# Altium project FPGA_Project.PrjPCB
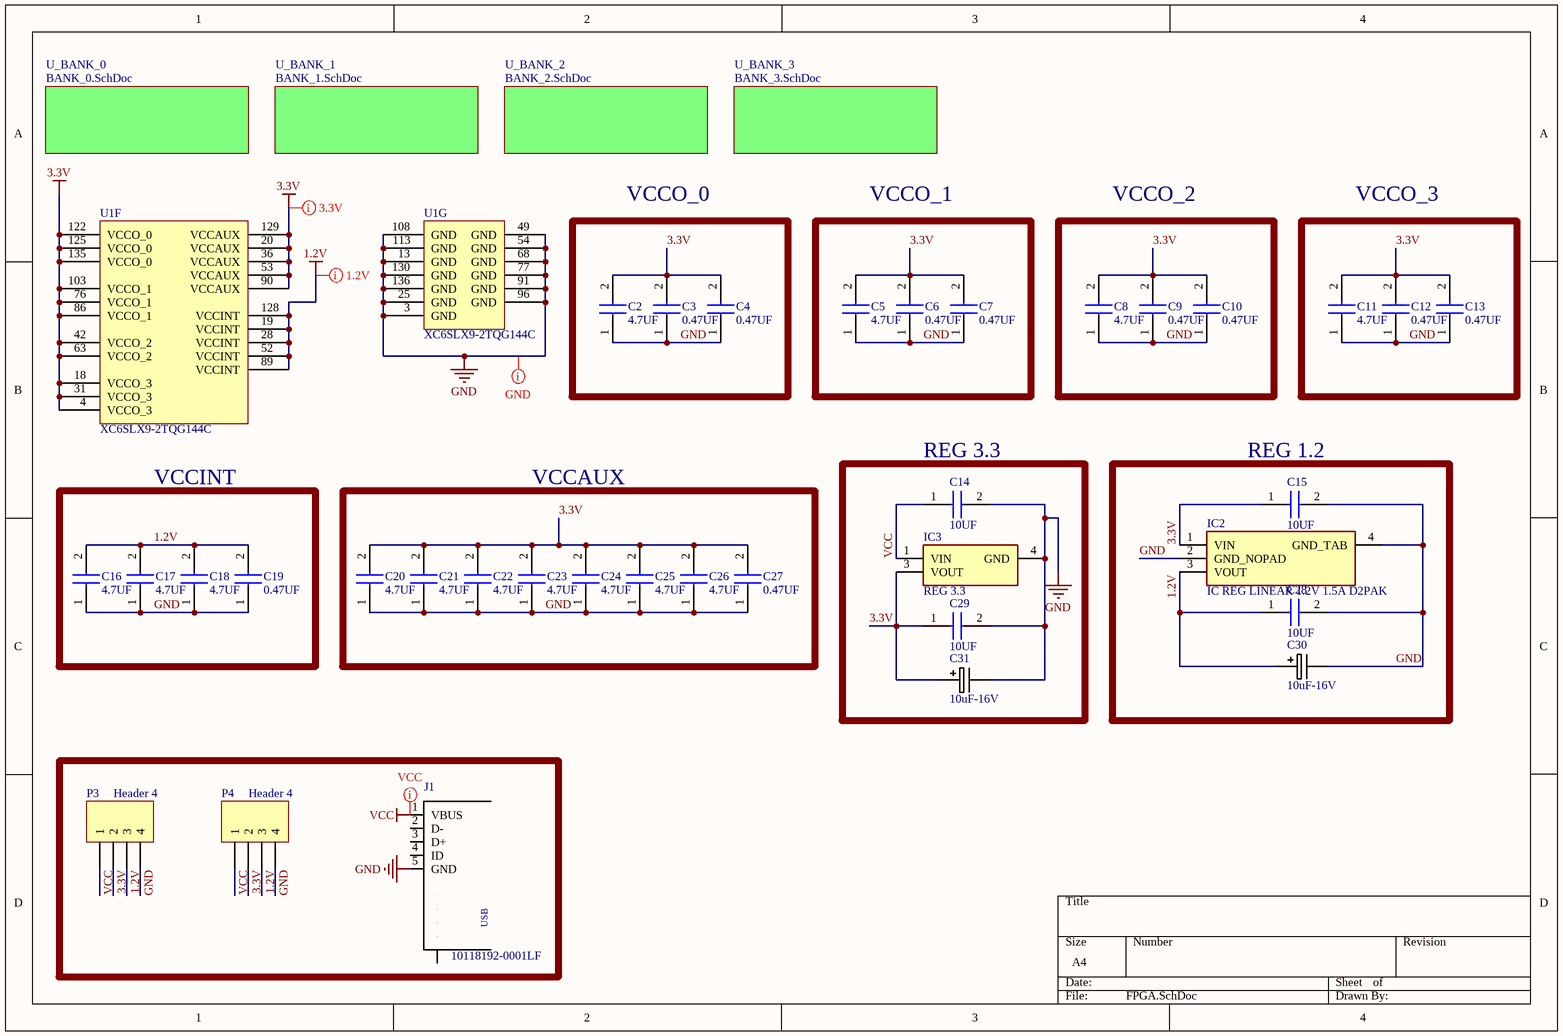
[diagram p0: FPGA.SchDoc]
5 sheets, 57 parts. Net scope: global (net labels, ports and power ports of the same name join across sheets).
Board file: FPGA_PCB.PcbDoc
Sheets:
  FPGA.SchDoc
    U_BANK_0 = BANK_0.SchDoc
    U_BANK_1 = BANK_1.SchDoc
    U_BANK_2 = BANK_2.SchDoc
    U_BANK_3 = BANK_3.SchDoc

## Sheet FPGA.SchDoc
size A4

### Parts
C2  4.7UF  [CAPC2012X135N]
C3  0.47UF  [CAPC2012X135N]
C4  0.47UF  [CAPC2012X135N]
C5  4.7UF  [CAPC2012X135N]
C6  0.47UF  [CAPC2012X135N]
C7  0.47UF  [CAPC2012X135N]
C8  4.7UF  [CAPC2012X135N]
C9  0.47UF  [CAPC2012X135N]
C10  0.47UF  [CAPC2012X135N]
C11  4.7UF  [CAPC2012X135N]
C12  0.47UF  [CAPC2012X135N]
C13  0.47UF  [CAPC2012X135N]
C14  10UF  [CAPC2012X135N]
C15  10UF  [CAPC2012X135N]
C16  4.7UF  [CAPC2012X135N]
C17  4.7UF  [CAPC2012X135N]
C18  4.7UF  [CAPC2012X135N]
C19  0.47UF  [CAPC2012X135N]
C20  4.7UF  [CAPC2012X135N]
C21  4.7UF  [CAPC2012X135N]
C22  4.7UF  [CAPC2012X135N]
C23  4.7UF  [CAPC2012X135N]
C24  4.7UF  [CAPC2012X135N]
C25  4.7UF  [CAPC2012X135N]
C26  4.7UF  [CAPC2012X135N]
C27  0.47UF  [CAPC2012X135N]
C28  10UF  [CAPC2012X135N]
C29  10UF  [CAPC2012X135N]
C30  10uF-16V  [PANACAP-b]
C31  10uF-16V  [PANACAP-b]
IC2  IC REG LINEAR 1.2V 1.5A D2PAK  [TO254P1420X457-4N]
IC3  REG 3.3  [NCV8674DS50R4G]
J1  10118192-0001LF  [10118192-0001LF_10118192-0001LF(Primary)]
P3  Header 4  [HDR1X4]
P4  Header 4  [HDR1X4]
U1  XC6SLX9-2TQG144C  [TQG144_N]  (parts F,G of 7)

### Blocks framed on the sheet
VCCO_0: C2-C4
VCCO_1: C5-C7
VCCO_2: C8-C10
VCCO_3: C11-C13
VCCINT: C16-C19
VCCAUX: C20-C27
REG 3.3: C14 C29 C31 IC3
REG 1.2: C15 C28 C30 IC2

### Sub-sheets
U_BANK_0 = BANK_0.SchDoc: no entries
U_BANK_1 = BANK_1.SchDoc: no entries
U_BANK_2 = BANK_2.SchDoc: no entries
U_BANK_3 = BANK_3.SchDoc: no entries

### Nets
1.2V: C16.2 C17.2 C18.2 C19.2 C28.1 C30.+ IC2.3(VOUT) P3.3 P4.3 U1.19(VCCINT) U1.28(VCCINT) U1.52(VCCINT) U1.89(VCCINT) U1.128(VCCINT)
3.3V: C2.2 C3.2 C4.2 C5.2 C6.2 C7.2 C8.2 C9.2 C10.2 C11.2 C12.2 C13.2 C15.1 C20.2 C21.2 C22.2 C23.2 C24.2 C25.2 C26.2 C27.2 C29.1 C31.+ IC2.1(VIN) IC3.3(VOUT) P3.2 P4.2 U1.4(VCCO_3) U1.18(VCCO_3) U1.20(VCCAUX) U1.31(VCCO_3) U1.36(VCCAUX) U1.42(VCCO_2) U1.53(VCCAUX) U1.63(VCCO_2) U1.76(VCCO_1) U1.86(VCCO_1) U1.90(VCCAUX) U1.103(VCCO_1) U1.122(VCCO_0) U1.125(VCCO_0) U1.129(VCCAUX) U1.135(VCCO_0)
GND: C2.1 C3.1 C4.1 C5.1 C6.1 C7.1 C8.1 C9.1 C10.1 C11.1 C12.1 C13.1 C14.2 C15.2 C16.1 C17.1 C18.1 C19.1 C20.1 C21.1 C22.1 C23.1 C24.1 C25.1 C26.1 C27.1 C28.2 C29.2 C30.- C31.- IC2.2(GND_NOPAD) IC2.4(GND_TAB) IC3.4(GND) J1.5(GND) P3.4 P4.4 U1.3(GND) U1.13(GND) U1.25(GND) U1.49(GND) U1.54(GND) U1.68(GND) U1.77(GND) U1.91(GND) U1.96(GND) U1.108(GND) U1.113(GND) U1.130(GND) U1.136(GND)
VCC: C14.1 IC3.1(VIN) J1.1(VBUS) P3.1 P4.1

Not connected (* = marked no-connect by the designer): J1 2(D-) 3(D+) 4(ID) M1(S) M2(S) S1(S) S2(S) S3(S) S4(S)

### Layout directives
rule Width Constraint [Pref Width = 15.748mil    Min Width = 11.811mil    Max Width = 15.748mil]: 1.2V, 3.3V, GND, VCC

### Notes on the sheet
- (in symbol 10118192-0001LF) USB

### Library data of the parts
C2 C5 C8 C11 C16-C18 C20-C26 = CAP CER 4.7UF 16V X5R 0805: Capacitor; Manufacturer_Name: Wurth Elektronik; Manufacturer_Part_Number: 885012107013; Datasheet Link: https://katalog.we-online.com/pbs/datasheet/885012107013.pdf; Height: 1.35mm; Mouser Part Number: 710-885012107013; Mouser Price/Stock: https://www.mouser.com/Search/Refine.aspx?Keyword=710-885012107013; RS Part Number: 1814065P; RS Price/Stock: http://uk.rs-online.com/web/p/products/1814065P
C3 C4 C6 C7 C9 C10 C12 C13 C19 C27 = CAP CER 0.47UF 16V X7R 0805: Capacitor; Manufacturer_Name: Wurth Elektronik; Manufacturer_Part_Number: 885012207049; Datasheet Link: https://katalog.we-online.com/pbs/datasheet/885012207049.pdf; Height: 1.35mm; Mouser Part Number: 710-885012207049; Mouser Price/Stock: https://www.mouser.com/Search/Refine.aspx?Keyword=710-885012207049
C14 C15 C28 C29 = CAP CER 10UF 16V X5R 0805: Capacitor; Manufacturer_Name: Wurth Elektronik; Manufacturer_Part_Number: 885012107013; Datasheet Link: https://katalog.we-online.com/pbs/datasheet/885012107013.pdf; Height: 1.35mm; Mouser Part Number: 710-885012107013; Mouser Price/Stock: https://www.mouser.com/Search/Refine.aspx?Keyword=710-885012107013; RS Part Number: 1814065P; RS Price/Stock: http://uk.rs-online.com/web/p/products/1814065P
C30 C31 = PANACAP-10UF-16V-FK: GENERIC CAPACITOR POLARISED; Supplier 1: Digi-Key; Supplier Part Number 1: PCE3782TR-ND
IC2 = IC REG LINEAR 1.2V 1.5A D2PAK: Integrated Circuit; Manufacturer_Name: ON Semiconductor; Manufacturer_Part_Number: NCP565D2T12G; Allied_Number: 70340882; Datasheet Link: http://www.onsemi.com/pub/Collateral/NCP565-D.PDF; Height: 4.572mm; Mouser Part Number: 863-NCP565D2T12G; Mouser Price/Stock: https://www.mouser.com/Search/Refine.aspx?Keyword=863-NCP565D2T12G; RS Part Number: 0464164; RS Price/Stock: http://uk.rs-online.com/web/p/products/0464164; Allied Price/Stock: http://www.alliedelec.com/on-semiconductor-ncp565d2t12g/70340882/
IC3 = IC REG LINEAR 3.3V 1.5A D2PAK: Integrated Circuit; Manufacturer_Name: ON Semiconductor; Manufacturer_Part_Number: NCP565D2T33R4G; Datasheet Link: https://www.onsemi.com/pub/Collateral/NCP565-D.PDF; Height: 4mm; Mouser Part Number: 863-NCP565D2T33R4G; Mouser Price/Stock: https://www.mouser.com/Search/Refine.aspx?Keyword=863-NCP565D2T33R4G; RS Part Number: 7852432P; RS Price/Stock: http://uk.rs-online.com/web/p/products/7852432P
J1 = 10118192-0001LF: Conn Micro USB Type B RCP 5 POS 0.65mm Solder RA SMD 5 Terminal 1 Port T/R; MF: Amphenol; Price: 0.23 USD; MP: 10118192-0001LF; Availability: Good; SnapEDA_Link: https://www.snapeda.com/parts/10118192-0001LF/Amphenol%20Solar/view-part/?ref=snap; Package: None; Value: *
P3 P4 = Header 4: Header, 4-Pin; LatestRevisionDate: 17-Jul-2002; LatestRevisionNote: Re-released for DXP Platform.; Publisher: Altium Limited
U1 = XC6SLX9-2TQG144C: Spartan-6 LX 1.2V FPGA, 102 User I/Os, 144-Pin TQFP (0.5mm Pitch), Speed Grade 2, Commercial Grade, Pb-Free; DatasheetVersion: ver1.6, Nov-2010; PackageVersion: ver1.2, Jun-2004; PackageReference: TQG144; PackageDescription: 144-Pin Thin Quad Flat Pack (TQG144) - Pb-Free; Code_JEDEC: MS-026-BFB; ComponentLink1Description: Manufacturer URL; ComponentLink1URL: http://www.xilinx.com/; ComponentLink2Description: Spartan-6 Datasheet; ComponentLink2URL: http://www.xilinx.com/support/documentation/data_sheets/ds160.pdf; ComponentLink3Description: Spartan-6 Documents; ComponentLink3URL: http://www.xilinx.com/support/documentation/spartan-6.htm

## Sheet BANK_0.SchDoc
size A4
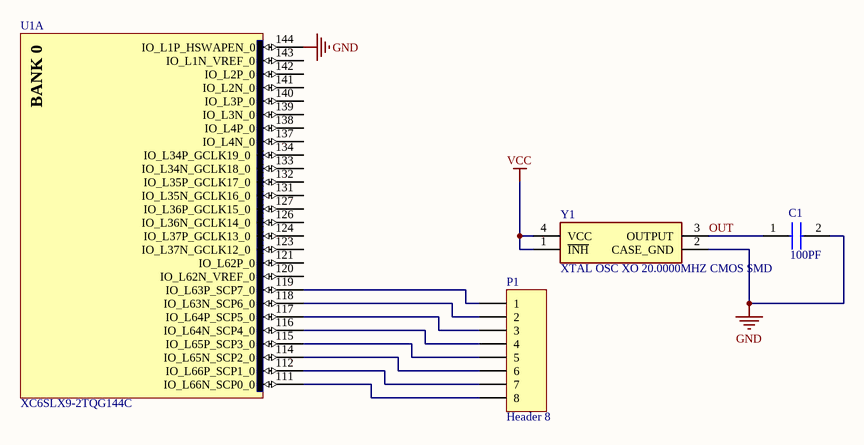
[diagram p1: BANK_0.SchDoc]

### Parts
C1  100PF  [CAPC2012X90N]
P1  Header 8  [HDR1X8]
U1  XC6SLX9-2TQG144C  [TQG144_N]  (part A of 7)
Y1  XTAL OSC XO 20.0000MHZ CMOS SMD  [KC5032A12.0000CM0E00]

### Nets
GND: C1.2 U1.144(IO_L1P_HSWAPEN_0) Y1.2(CASE_GND)
VCC: Y1.1(~{INH}) Y1.4(VCC)
OUT: C1.1 Y1.3(OUTPUT)
NetP1_1: P1.1 U1.119(IO_L63P_SCP7_0)
NetP1_2: P1.2 U1.118(IO_L63N_SCP6_0)
NetP1_3: P1.3 U1.117(IO_L64P_SCP5_0)
NetP1_4: P1.4 U1.116(IO_L64N_SCP4_0)
NetP1_5: P1.5 U1.115(IO_L65P_SCP3_0)
NetP1_6: P1.6 U1.114(IO_L65N_SCP2_0)
NetP1_7: P1.7 U1.112(IO_L66P_SCP1_0)
NetP1_8: P1.8 U1.111(IO_L66N_SCP0_0)

Not connected (* = marked no-connect by the designer): U1 120(IO_L62N_VREF_0) 121(IO_L62P_0) 123(IO_L37N_GCLK12_0) 124(IO_L37P_GCLK13_0) 126(IO_L36N_GCLK14_0) 127(IO_L36P_GCLK15_0) 131(IO_L35N_GCLK16_0) 132(IO_L35P_GCLK17_0) 133(IO_L34N_GCLK18_0) 134(IO_L34P_GCLK19_0) 137(IO_L4N_0) 138(IO_L4P_0) 139(IO_L3N_0) 140(IO_L3P_0) 141(IO_L2N_0) 142(IO_L2P_0) 143(IO_L1N_VREF_0)

### Notes on the sheet
- (in symbol XC6SLX9-2TQG144C, part A) BANK 0

### Library data of the parts
C1 = CAP CER 0.1UF 16V X7R 0805: Capacitor; Manufacturer_Name: Wurth Elektronik; Manufacturer_Part_Number: 885012207045; Datasheet Link: https://katalog.we-online.com/pbs/datasheet/885012207045.pdf; Height: 0.9mm; Mouser Part Number: 710-885012207045; Mouser Price/Stock: https://www.mouser.com/Search/Refine.aspx?Keyword=710-885012207045; RS Part Number: 1814041P; RS Price/Stock: http://uk.rs-online.com/web/p/products/1814041P
P1 = Header 8: Header, 8-Pin; LatestRevisionDate: 17-Jul-2002; LatestRevisionNote: Re-released for DXP Platform.; Publisher: Altium Limited
U1 = XC6SLX9-2TQG144C: as U1 on sheet FPGA; DatasheetVersion: ver1.6, Nov-2010; PackageVersion: ver1.2, Jun-2004; PackageReference: TQG144; PackageDescription: 144-Pin Thin Quad Flat Pack (TQG144) - Pb-Free; Code_JEDEC: MS-026-BFB; ComponentLink1Description: Manufacturer URL; ComponentLink1URL: http://www.xilinx.com/; ComponentLink2Description: Spartan-6 Datasheet; ComponentLink2URL: http://www.xilinx.com/support/documentation/data_sheets/ds160.pdf; ComponentLink3Description: Spartan-6 Documents; ComponentLink3URL: http://www.xilinx.com/support/documentation/spartan-6.htm
Y1 = XTAL OSC XO 20.0000MHZ CMOS SMD: Crystal or Oscillator; Manufacturer_Name: KYOCERA; Manufacturer_Part_Number: KC5032A20.0000CMGE00; Datasheet Link: http://global.kyocera.com/prdct/electro/product/pdf/kc5032a_cm_e.pdf; Mouser Part Number: 581-KC5032A20.CMGE

## Sheet BANK_1.SchDoc
size A4
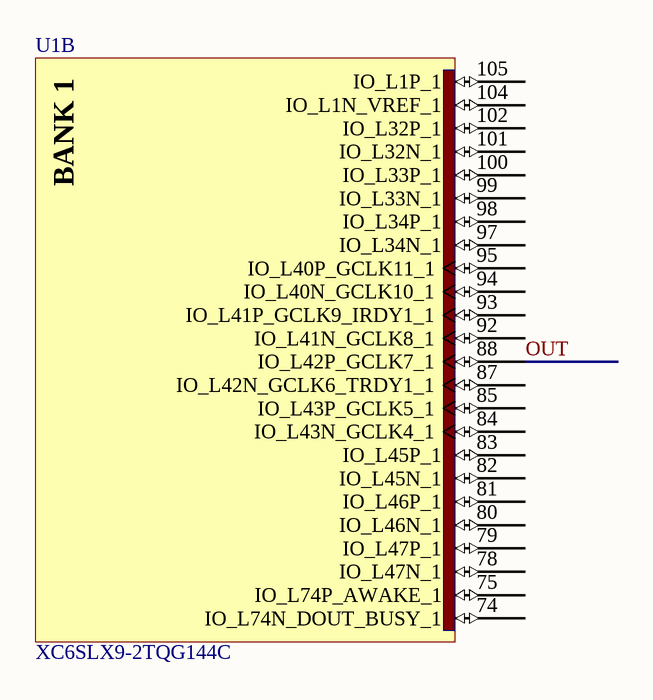
[diagram p2: BANK_1.SchDoc]

### Parts
U1  XC6SLX9-2TQG144C  [TQG144_N]  (part B of 7)

### Nets
OUT: U1.88(IO_L42P_GCLK7_1)

Not connected (* = marked no-connect by the designer): U1 74(IO_L74N_DOUT_BUSY_1) 75(IO_L74P_AWAKE_1) 78(IO_L47N_1) 79(IO_L47P_1) 80(IO_L46N_1) 81(IO_L46P_1) 82(IO_L45N_1) 83(IO_L45P_1) 84(IO_L43N_GCLK4_1) 85(IO_L43P_GCLK5_1) 87(IO_L42N_GCLK6_TRDY1_1) 92(IO_L41N_GCLK8_1) 93(IO_L41P_GCLK9_IRDY1_1) 94(IO_L40N_GCLK10_1) 95(IO_L40P_GCLK11_1) 97(IO_L34N_1) 98(IO_L34P_1) 99(IO_L33N_1) 100(IO_L33P_1) 101(IO_L32N_1) 102(IO_L32P_1) 104(IO_L1N_VREF_1) 105(IO_L1P_1)

### Notes on the sheet
- (in symbol XC6SLX9-2TQG144C, part B) BANK 1

### Library data of the parts
U1 = XC6SLX9-2TQG144C: as U1 on sheet FPGA; DatasheetVersion: ver1.6, Nov-2010; PackageVersion: ver1.2, Jun-2004; PackageReference: TQG144; PackageDescription: 144-Pin Thin Quad Flat Pack (TQG144) - Pb-Free; Code_JEDEC: MS-026-BFB; ComponentLink1Description: Manufacturer URL; ComponentLink1URL: http://www.xilinx.com/; ComponentLink2Description: Spartan-6 Datasheet; ComponentLink2URL: http://www.xilinx.com/support/documentation/data_sheets/ds160.pdf; ComponentLink3Description: Spartan-6 Documents; ComponentLink3URL: http://www.xilinx.com/support/documentation/spartan-6.htm

## Sheet BANK_2.SchDoc
size A4
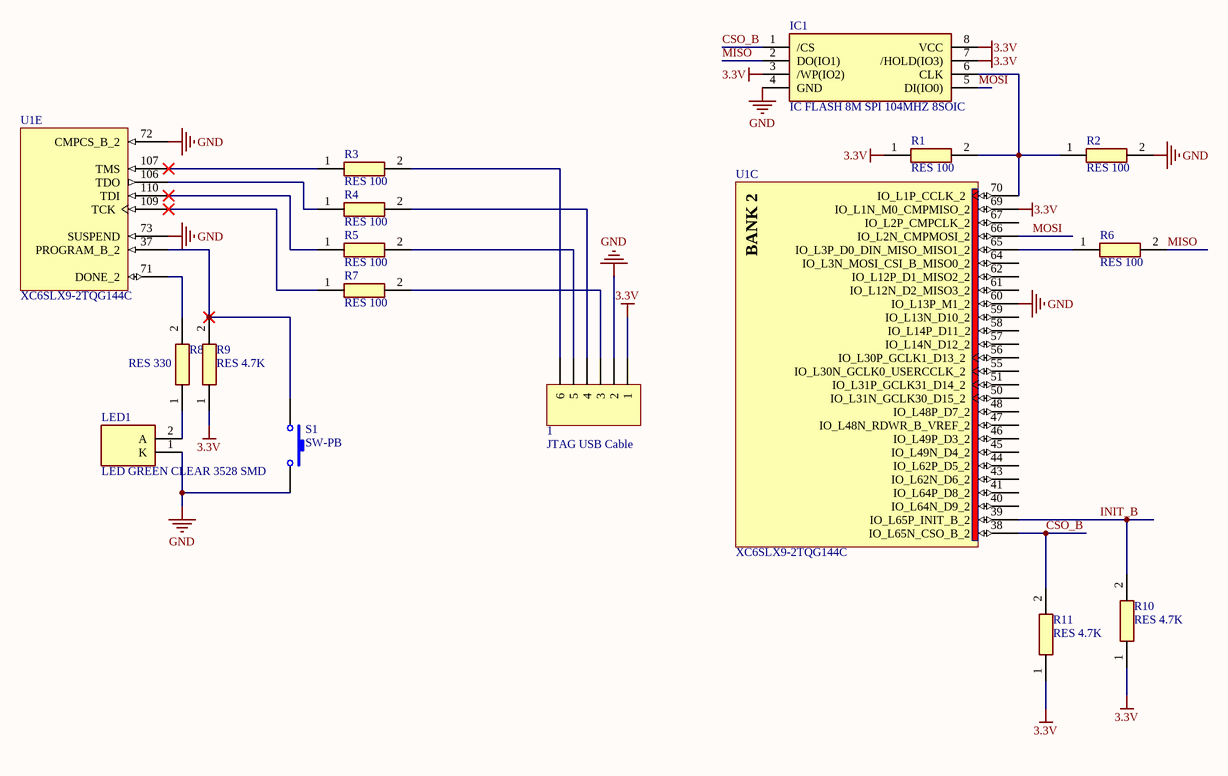
[diagram p3: BANK_2.SchDoc]

### Parts
1  JTAG USB Cable  [HDR1X6]
IC1  IC FLASH 8M SPI 104MHZ 8SOIC  [SOIC127P790X216-8N]
LED1  LED GREEN CLEAR 3528 SMD  [LEDM3528X210N]
R1  RES 100  [RESC2012X65N]
R2  RES 100  [RESC2012X65N]
R3  RES 100  [RESC2012X65N]
R4  RES 100  [RESC2012X65N]
R5  RES 100  [RESC2012X65N]
R6  RES 100  [RESC2012X65N]
R7  RES 100  [RESC2012X65N]
R8  RES 330  [RESC2012X65N]
R9  RES 4.7K  [RESC2012X60N]
R10  RES 4.7K  [RESC2012X60N]
R11  RES 4.7K  [RESC2012X60N]
S1  SW-PB  [SPST-2]
U1  XC6SLX9-2TQG144C  [TQG144_N]  (parts C,E of 7)

### Nets
3.3V: 1.1 IC1.3(/WP(IO2)) IC1.7(/HOLD(IO3)) IC1.8(VCC) R1.1 R9.1 R10.1 R11.1 U1.69(IO_L1N_M0_CMPMISO_2)
GND: 1.2 IC1.4(GND) LED1.1(K) R2.2 S1.2 U1.60(IO_L13P_M1_2) U1.72(CMPCS_B_2) U1.73(SUSPEND)
CSO_B: IC1.1(/CS) R11.2 U1.38(IO_L65N_CSO_B_2)
INIT_B: R10.2 U1.39(IO_L65P_INIT_B_2)
MISO: IC1.2(DO(IO1)) R6.2
MOSI: IC1.5(DI(IO0)) U1.66(IO_L2N_CMPMOSI_2)
Net1_3: 1.3 R7.2
Net1_4: 1.4 R4.2
Net1_5: 1.5 R5.2
Net1_6: 1.6 R3.2
NetIC1_6: IC1.6(CLK) R1.2 R2.1 U1.70(IO_L1P_CCLK_2)
NetLED1_2: LED1.2(A) R8.1
NetR3_1: R3.1 U1.107(TMS)
NetR4_1: R4.1 U1.106(TDO)
NetR5_1: R5.1 U1.110(TDI)
NetR6_1: R6.1 U1.65(IO_L3P_D0_DIN_MISO_MISO1_2)
NetR7_1: R7.1 U1.109(TCK)
NetR8_2: R8.2 U1.71(DONE_2)
NetR9_2: R9.2 S1.1 U1.37(PROGRAM_B_2)

Not connected (* = marked no-connect by the designer): U1 40(IO_L64N_D9_2) 41(IO_L64P_D8_2) 43(IO_L62N_D6_2) 44(IO_L62P_D5_2) 45(IO_L49N_D4_2) 46(IO_L49P_D3_2) 47(IO_L48N_RDWR_B_VREF_2) 48(IO_L48P_D7_2) 50(IO_L31N_GCLK30_D15_2) 51(IO_L31P_GCLK31_D14_2) 55(IO_L30N_GCLK0_USERCCLK_2) 56(IO_L30P_GCLK1_D13_2) 57(IO_L14N_D12_2) 58(IO_L14P_D11_2) 59(IO_L13N_D10_2) 61(IO_L12N_D2_MISO3_2) 62(IO_L12P_D1_MISO2_2) 64(IO_L3N_MOSI_CSI_B_MISO0_2) 67(IO_L2P_CMPCLK_2)

### Notes on the sheet
- (in symbol XC6SLX9-2TQG144C, part C) BANK 2

### Library data of the parts
1 = JTAG USB Cable: DIGILENT         250-003            PROGRAMMING CABLE, JTAG TO USB; Supplier 1: Digi-Key; Manufacturer: Digilent; Manufacturer Part Number: 250-003; Stock 1: 33; Pricing 1: 1=59 (USD); Number of Pins: 6; Package Quantity: 1; REACH SVHC: No SVHC; ComponentLink1URL: http://www.digilentinc.com/Data/Products/JTAG-USB/JTAG-USB%20Cable_rm.pdf?src-supplier=Digi-Key; ComponentLink1Description: http://www.digilentinc.com/Data/Products/JTAG-USB/JTAG-USB%20Cable_rm.pdf?src-supplier=Digi-Key; Category: Programmers; Supplier Part Number 1: 1286-1052-ND
IC1 = IC FLASH 8M SPI 104MHZ 8SOIC: Integrated Circuit; Manufacturer_Name: Winbond; Manufacturer_Part_Number: W25Q80DVSSIG; Datasheet Link: https://www.winbond.com/resource-files/w25q80dv_revf_02112015.pdf; Height: 2.16mm; Mouser Part Number: 454-W25Q80DVSSIG; Mouser Price/Stock: https://www.mouser.com/Search/Refine.aspx?Keyword=454-W25Q80DVSSIG; RS Part Number: 1882614P; RS Price/Stock: http://uk.rs-online.com/web/p/products/1882614P
LED1 = LED GREEN CLEAR 3528 SMD: LED; Manufacturer_Name: Wurth Elektronik; Manufacturer_Part_Number: 150141GS73100; Datasheet Link: https://www.mouser.com/datasheet/2/445/150141GS73100-368683.pdf; Height: 2.1mm; Mouser Part Number: 710-150141GS73100; Mouser Price/Stock: https://www.mouser.com/Search/Refine.aspx?Keyword=710-150141GS73100; RS Part Number: 8154316P; RS Price/Stock: http://uk.rs-online.com/web/p/products/8154316P
R1-R7 = RES SMD 100 OHM 5% 1/8W 0805: Resistor; Manufacturer_Name: TE Connectivity; Manufacturer_Part_Number: CRG0805J100R; Datasheet Link: http://www.te.com/commerce/DocumentDelivery/DDEController?Action=showdoc&DocId=Customer+Drawing%7F1623109%7FBA%7Fpdf%7FEnglish%7FENG_CD_1623109_BA.pdf%7F1623109-1; Height: 0.65mm; Mouser Part Number: 279-CRG0805J100R; Mouser Price/Stock: https://www.mouser.com/Search/Refine.aspx?Keyword=279-CRG0805J100R
R8 = RES SMD 330 OHM 1% 1/8W 0805: Resistor; Manufacturer_Name: TE Connectivity; Manufacturer_Part_Number: CRG0805F330R; Allied_Number: 70063207; Datasheet Link: http://www.te.com/commerce/DocumentDelivery/DDEController?Action=showdoc&DocId=Customer+Drawing%7F1623109%7FBA%7Fpdf%7FEnglish%7FENG_CD_1623109_BA.pdf%7F1623109-1; Height: 0.65mm; Mouser Part Number: 279-CRG0805F330R; Mouser Price/Stock: https://www.mouser.com/Search/Refine.aspx?Keyword=279-CRG0805F330R; RS Part Number: 2230354P; RS Price/Stock: http://uk.rs-online.com/web/p/products/2230354P; Allied Price/Stock: https://www.alliedelec.com/te-connectivity-crg0805f330r/70063207/
R9-R11 = RES SMD 4.7K OHM 1% 1/8W 0805: Resistor; Manufacturer_Name: YAGEO (PHYCOMP); Manufacturer_Part_Number: RC0805FR-074K7L; Datasheet Link: http://www.yageo.com/documents/recent/PYu-RC_Group_51_RoHS_L_10.pdf; Height: 0.6mm; Mouser Part Number: 603-RC0805FR-074K7L; Mouser Price/Stock: https://www.mouser.com/Search/Refine.aspx?Keyword=603-RC0805FR-074K7L; RS Part Number: 6181408; RS Price/Stock: http://uk.rs-online.com/web/p/products/6181408
S1 = SW-PB: Switch; Published: 24-Mar-1999; LatestRevisionDate: 17-Jul-2002; LatestRevisionNote: Re-released for DXP Platform.; PackageReference: SPST-2; Publisher: Altium Limited; PackageDescription: Switch; 2 Leads
U1 = XC6SLX9-2TQG144C: as U1 on sheet FPGA; DatasheetVersion: ver1.6, Nov-2010; PackageVersion: ver1.2, Jun-2004; PackageReference: TQG144; PackageDescription: 144-Pin Thin Quad Flat Pack (TQG144) - Pb-Free; Code_JEDEC: MS-026-BFB; ComponentLink1Description: Manufacturer URL; ComponentLink1URL: http://www.xilinx.com/; ComponentLink2Description: Spartan-6 Datasheet; ComponentLink2URL: http://www.xilinx.com/support/documentation/data_sheets/ds160.pdf; ComponentLink3Description: Spartan-6 Documents; ComponentLink3URL: http://www.xilinx.com/support/documentation/spartan-6.htm

## Sheet BANK_3.SchDoc
size A4
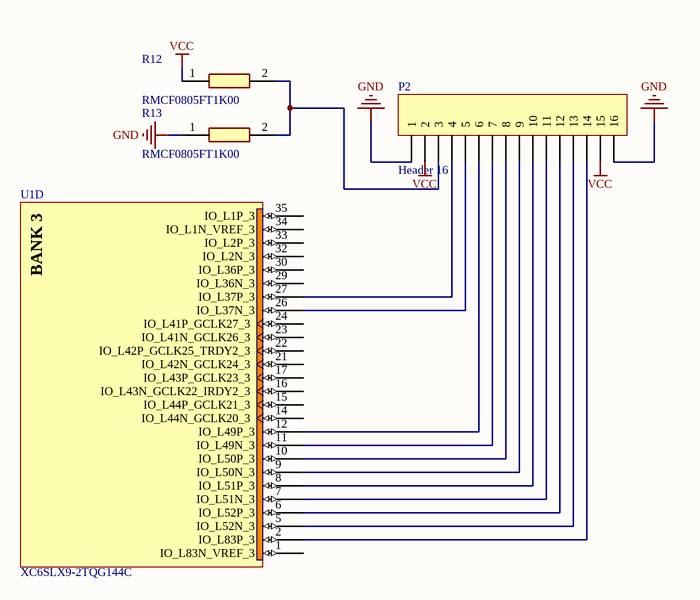
[diagram p4: BANK_3.SchDoc]

### Parts
P2  Header 16  [HDR1X16]
R12  RMCF0805FT1K00  [RESC2012X65N]
R13  RMCF0805FT1K00  [RESC2012X65N]
U1  XC6SLX9-2TQG144C  [TQG144_N]  (part D of 7)

### Nets
GND: P2.1 P2.16 R13.1
VCC: P2.2 P2.15 R12.1
NetP2_3: P2.3 R12.2 R13.2
NetP2_4: P2.4 U1.27(IO_L37P_3)
NetP2_5: P2.5 U1.26(IO_L37N_3)
NetP2_6: P2.6 U1.12(IO_L49P_3)
NetP2_7: P2.7 U1.11(IO_L49N_3)
NetP2_8: P2.8 U1.10(IO_L50P_3)
NetP2_9: P2.9 U1.9(IO_L50N_3)
NetP2_10: P2.10 U1.8(IO_L51P_3)
NetP2_11: P2.11 U1.7(IO_L51N_3)
NetP2_12: P2.12 U1.6(IO_L52P_3)
NetP2_13: P2.13 U1.5(IO_L52N_3)
NetP2_14: P2.14 U1.2(IO_L83P_3)

Not connected (* = marked no-connect by the designer): U1 1(IO_L83N_VREF_3) 14(IO_L44N_GCLK20_3) 15(IO_L44P_GCLK21_3) 16(IO_L43N_GCLK22_IRDY2_3) 17(IO_L43P_GCLK23_3) 21(IO_L42N_GCLK24_3) 22(IO_L42P_GCLK25_TRDY2_3) 23(IO_L41N_GCLK26_3) 24(IO_L41P_GCLK27_3) 29(IO_L36N_3) 30(IO_L36P_3) 32(IO_L2N_3) 33(IO_L2P_3) 34(IO_L1N_VREF_3) 35(IO_L1P_3)

### Notes on the sheet
- (in symbol XC6SLX9-2TQG144C, part D) BANK 3

### Library data of the parts
P2 = Header 16: Header, 16-Pin; LatestRevisionDate: 17-Jul-2002; LatestRevisionNote: Re-released for DXP Platform.; Publisher: Altium Limited
R12 R13 = RES 1K OHM 1% 1/8W 0805: Resistor; MF: Stackpole Electronics Inc; Price: None; Package: 2012 Stackpole; SnapEDA_Link: https://www.snapeda.com/parts/RMCF0805FT1K00/Stackpole%20Electronics%20Inc/view-part/3228308/?ref=snap; MP: RMCF0805FT1K00; Availability: Unavailable; Value: *
U1 = XC6SLX9-2TQG144C: as U1 on sheet FPGA; DatasheetVersion: ver1.6, Nov-2010; PackageVersion: ver1.2, Jun-2004; PackageReference: TQG144; PackageDescription: 144-Pin Thin Quad Flat Pack (TQG144) - Pb-Free; Code_JEDEC: MS-026-BFB; ComponentLink1Description: Manufacturer URL; ComponentLink1URL: http://www.xilinx.com/; ComponentLink2Description: Spartan-6 Datasheet; ComponentLink2URL: http://www.xilinx.com/support/documentation/data_sheets/ds160.pdf; ComponentLink3Description: Spartan-6 Documents; ComponentLink3URL: http://www.xilinx.com/support/documentation/spartan-6.htm

## Nets that join several sheets
3.3V: FPGA (43 pins), BANK_2 (9 pins)
GND: FPGA (49 pins), BANK_0 (C1.2 U1.144 Y1.2), BANK_2 (8 pins), BANK_3 (P2.1 P2.16 R13.1)
VCC: FPGA (5 pins), BANK_0 (Y1.1 Y1.4), BANK_3 (P2.2 P2.15 R12.1)
OUT: BANK_0 (C1.1 Y1.3), BANK_1 (U1.88)